# Altium schematic sheet EFUSE_NCP349.SchDoc
size A3
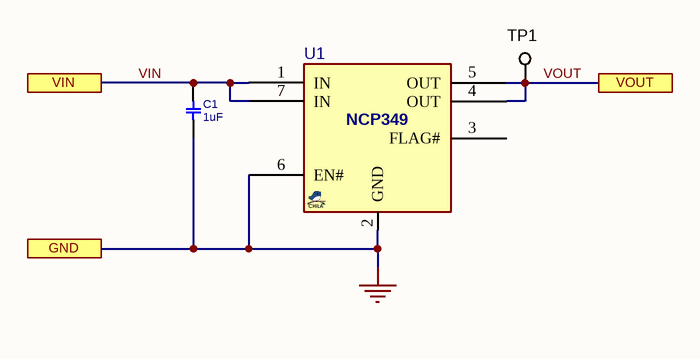
[diagram p0: EFUSE_NCP349.SchDoc]

## Parts
C1  1uF  [C0402]
TP1  TESTPOINT_SMD  [TPSMD_S1]  (value not drawn)  (no BOM)
U1  NCP349  [SON50_6T_1620]  (value not drawn)

## Ports
GND, VIN, VOUT

## Nets
GND: C1.1 U1.2(GND) U1.6(EN#) ; port GND
VIN: C1.2 U1.1(IN) U1.7(IN) ; port VIN
VOUT: TP1.1 U1.4(OUT) U1.5(OUT) ; port VOUT

Not connected (* = marked no-connect by the designer): U1 3(FLAG#)

## Library data of the parts
C1 = CAP_SMD_MLCC: CAP, MLCC; PARAM: X5R, 10%; MANF_P#: CL05A105KO5NNND; MANF: Samsung; PARAM2: 16v; PRICE: 50,000:	$0.006; ASSEMBLY: ASSEMBLY; VALUE: 1uF
TP1 = TESTPOINT_SMD: TEST POINT; MANF: MANF; MANF_P#: MANF_P#; VALUE: VALUE
U1 = NCP349_SON6: LOAD SW, 5V eFuse, 2A, 1.2~28V, 28mOhm , DFN-6; MANF: ON; MANF_P#: NCP349MN; PARAM2: 1.2~28v, +OverVoltageClamp; PARAM: 2A, 65mOhm, -40~85°C; PRICE: 0.6$; VALUE: NCP349